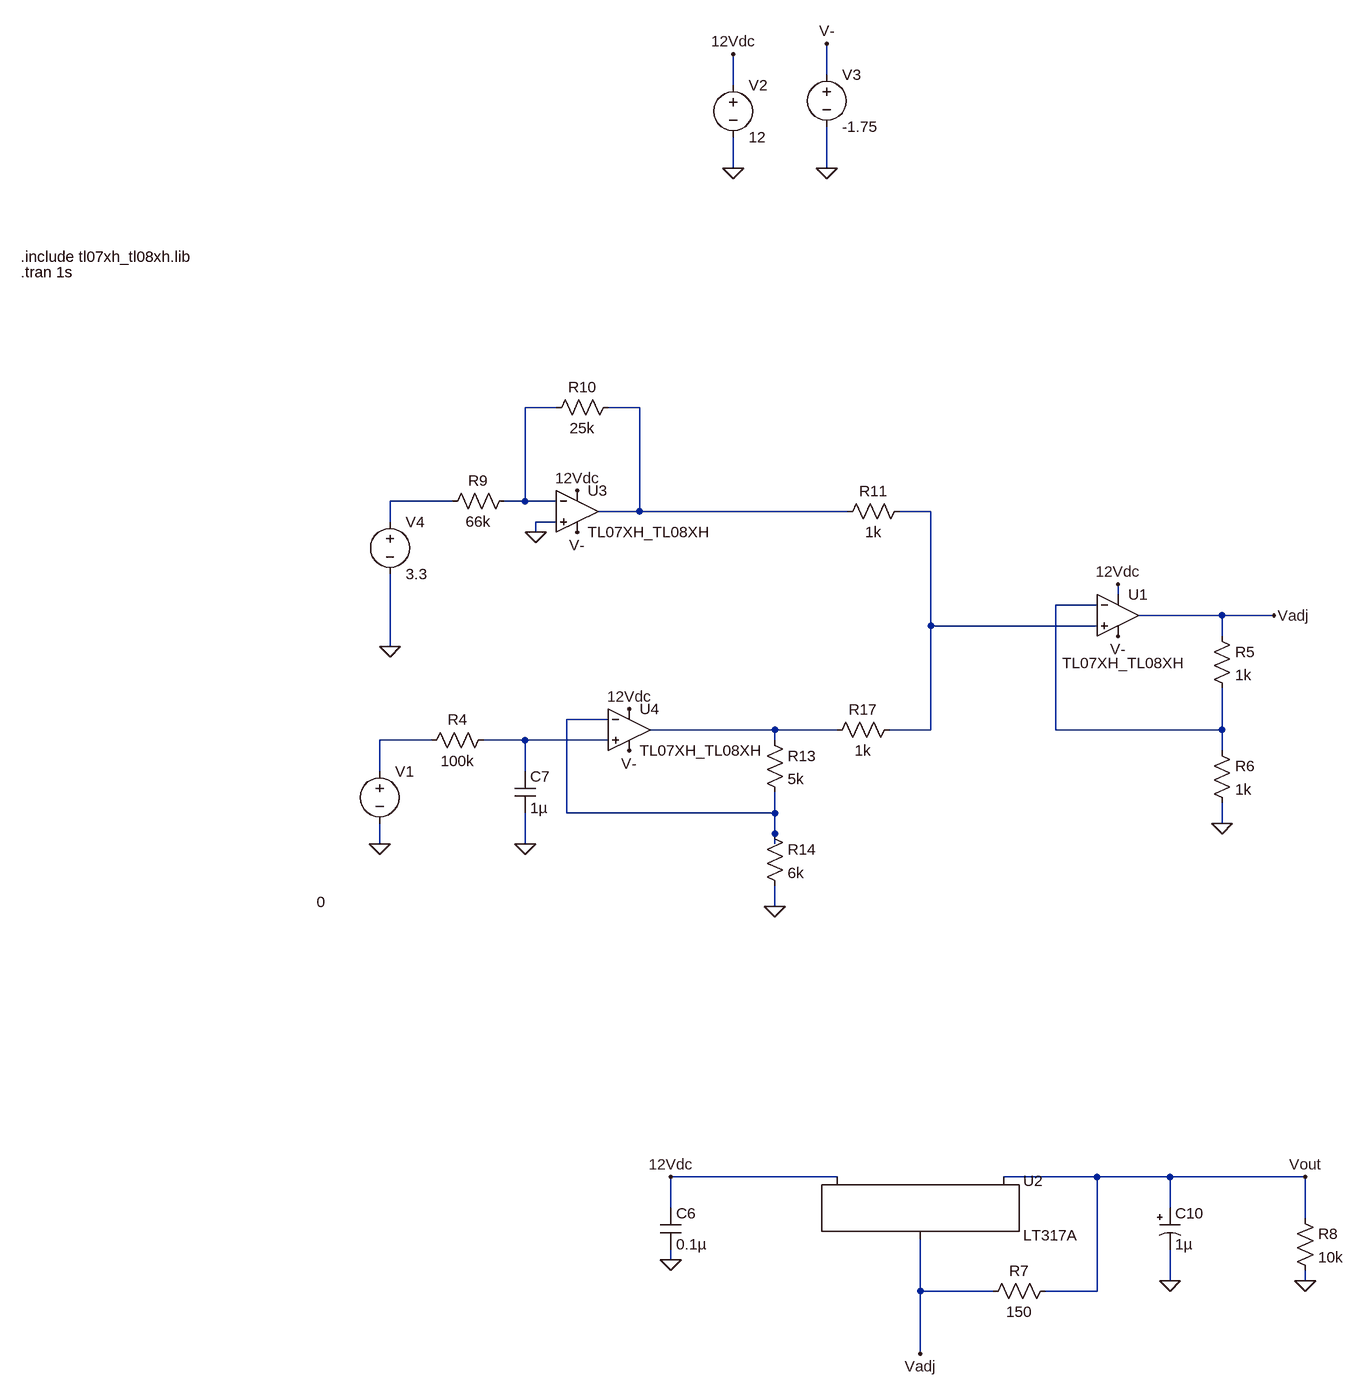
[diagram p0: schematic Draft2.asc]
Draft2.asc, the LTspice schematic file:
Version 4
SHEET 1 4228 3264
WIRE 800 752 800 704
WIRE 656 768 656 720
WIRE 656 896 656 848
WIRE 800 896 800 832
WIRE 384 1264 336 1264
WIRE 512 1264 464 1264
WIRE 224 1408 128 1408
WIRE 336 1408 336 1264
WIRE 336 1408 304 1408
WIRE 384 1408 336 1408
WIRE 512 1424 512 1264
WIRE 512 1424 448 1424
WIRE 832 1424 512 1424
WIRE 960 1424 912 1424
WIRE 128 1440 128 1408
WIRE 384 1440 352 1440
WIRE 352 1456 352 1440
WIRE 1248 1552 1248 1536
WIRE 1216 1568 1152 1568
WIRE 1408 1584 1280 1584
WIRE 1488 1584 1408 1584
WIRE 960 1600 960 1424
WIRE 1216 1600 960 1600
WIRE 1408 1616 1408 1584
WIRE 128 1632 128 1520
WIRE 464 1744 400 1744
WIRE 720 1760 528 1760
WIRE 816 1760 720 1760
WIRE 960 1760 960 1600
WIRE 960 1760 896 1760
WIRE 1152 1760 1152 1568
WIRE 1408 1760 1408 1696
WIRE 1408 1760 1152 1760
WIRE 192 1776 112 1776
WIRE 336 1776 272 1776
WIRE 464 1776 336 1776
WIRE 720 1776 720 1760
WIRE 1408 1792 1408 1760
WIRE 112 1824 112 1776
WIRE 336 1824 336 1776
WIRE 400 1888 400 1744
WIRE 720 1888 720 1856
WIRE 720 1888 400 1888
WIRE 1408 1904 1408 1872
WIRE 720 1920 720 1888
WIRE 112 1936 112 1904
WIRE 336 1936 336 1888
WIRE 720 1936 720 1920
WIRE 720 2032 720 2000
WIRE 816 2448 560 2448
WIRE 1216 2448 1072 2448
WIRE 1328 2448 1216 2448
WIRE 1536 2448 1328 2448
WIRE 560 2496 560 2448
WIRE 1328 2496 1328 2448
WIRE 1536 2512 1536 2448
WIRE 560 2576 560 2560
WIRE 1328 2608 1328 2560
WIRE 1536 2608 1536 2592
WIRE 944 2624 944 2544
WIRE 1056 2624 944 2624
WIRE 1216 2624 1216 2448
WIRE 1216 2624 1136 2624
WIRE 944 2720 944 2624
FLAG 560 2576 0
FLAG 1328 2608 0
FLAG 1536 2608 0
FLAG 560 2448 12Vdc
FLAG 112 1936 0
FLAG 336 1936 0
FLAG 1536 2448 Vout
FLAG 1408 1904 0
FLAG 1248 1616 V-
FLAG 352 1456 0
FLAG 128 1632 0
FLAG 416 1456 V-
FLAG 416 1392 12Vdc
FLAG 944 2720 Vadj
FLAG 1248 1536 12Vdc
FLAG 496 1728 12Vdc
FLAG 496 1792 V-
FLAG 720 2032 0
FLAG 1488 1584 Vadj
FLAG 656 896 0
FLAG 656 720 12Vdc
FLAG 800 896 0
FLAG 800 704 V-
SYMBOL PowerProducts\\LT317A 944 2448 R0
SYMATTR InstName U2
SYMBOL res 1152 2608 R90
WINDOW 0 0 56 VBottom 2
WINDOW 3 32 56 VTop 2
SYMATTR InstName R7
SYMATTR Value 150
SYMBOL res 1520 2496 R0
SYMATTR InstName R8
SYMATTR Value 10k
SYMBOL polcap 1312 2496 R0
SYMATTR InstName C10
SYMATTR Value 1µ
SYMATTR SpiceLine V=16
SYMBOL cap 544 2496 R0
SYMATTR InstName C6
SYMATTR Value 0.1µ
SYMATTR SpiceLine V=16
SYMBOL voltage 112 1808 R0
WINDOW 3 -97 217 Left 2
WINDOW 123 0 0 Left 0
WINDOW 39 0 0 Left 0
SYMATTR Value 0
SYMATTR InstName V1
SYMBOL res 288 1760 R90
WINDOW 0 0 56 VBottom 2
WINDOW 3 32 56 VTop 2
SYMATTR InstName R4
SYMATTR Value 100k
SYMBOL cap 320 1824 R0
SYMATTR InstName C7
SYMATTR Value 1µ
SYMBOL OpAmps\\opamp2 1248 1520 R0
WINDOW 3 -86 137 Left 2
SYMATTR Value TL07XH_TL08XH
SYMATTR InstName U1
SYMBOL res 1392 1600 R0
SYMATTR InstName R5
SYMATTR Value 1k
SYMBOL res 1392 1776 R0
SYMATTR InstName R6
SYMATTR Value 1k
SYMBOL OpAmps\\opamp2 416 1360 R0
SYMATTR InstName U3
SYMATTR Value TL07XH_TL08XH
SYMBOL voltage 128 1424 R0
WINDOW 123 0 0 Left 0
WINDOW 39 0 0 Left 0
SYMATTR InstName V4
SYMATTR Value 3.3
SYMBOL res 320 1392 R90
WINDOW 0 0 56 VBottom 2
WINDOW 3 32 56 VTop 2
SYMATTR InstName R9
SYMATTR Value 66k
SYMBOL res 480 1248 R90
WINDOW 0 0 56 VBottom 2
WINDOW 3 32 56 VTop 2
SYMATTR InstName R10
SYMATTR Value 25k
SYMBOL res 928 1408 R90
WINDOW 0 0 56 VBottom 2
WINDOW 3 32 56 VTop 2
SYMATTR InstName R11
SYMATTR Value 1k
SYMBOL OpAmps\\opamp2 496 1696 R0
SYMATTR InstName U4
SYMATTR Value TL07XH_TL08XH
SYMBOL res 704 1760 R0
SYMATTR InstName R13
SYMATTR Value 5k
SYMBOL res 704 1904 R0
SYMATTR InstName R14
SYMATTR Value 6k
SYMBOL res 912 1744 R90
WINDOW 0 0 56 VBottom 2
WINDOW 3 32 56 VTop 2
SYMATTR InstName R17
SYMATTR Value 1k
SYMBOL voltage 656 752 R0
WINDOW 123 0 0 Left 0
WINDOW 39 0 0 Left 0
SYMATTR InstName V2
SYMATTR Value 12
SYMBOL voltage 800 736 R0
WINDOW 123 0 0 Left 0
WINDOW 39 0 0 Left 0
SYMATTR InstName V3
SYMATTR Value -1.75
TEXT -440 1056 Left 2 !.tran 1s
TEXT -440 1032 Left 2 !.include tl07xh_tl08xh.lib

The netlist it stands for:
* Draft2.asc
XU2 Vadj Vout 12Vdc LT317A
R7 Vout Vadj 150
R8 Vout 0 10k
C10 Vout 0 1µ V=16
C6 12Vdc 0 0.1µ V=16
V1 N008 0 0
R4 N009 N008 100k
C7 N009 0 1µ
XU1 N004 N005 12Vdc V- Vadj TL07XH_TL08XH  ; pins In+ In- V+ V- OUT
R5 Vadj N005 1k
R6 N005 0 1k
XU3 0 N001 12Vdc V- N002 TL07XH_TL08XH  ; pins In+ In- V+ V- OUT
V4 N003 0 3.3
R9 N001 N003 66k
R10 N002 N001 25k
R11 N004 N002 1k
XU4 N009 N006 12Vdc V- N007 TL07XH_TL08XH  ; pins In+ In- V+ V- OUT
R13 N007 N006 5k
R14 N006 0 6k
R17 N004 N007 1k
V2 12Vdc 0 12
V3 V- 0 -1.75
.tran 1s
.include tl07xh_tl08xh.lib
.lib LTC.lib
.backanno
.end